# Altium schematic sheet JHDH-8412_1247.SchDoc: JHDH-8412-1247
size 469 x 304 mm; Revision: A; SheetNumber: 0; SheetTotal: 0; DrawnBy: CS
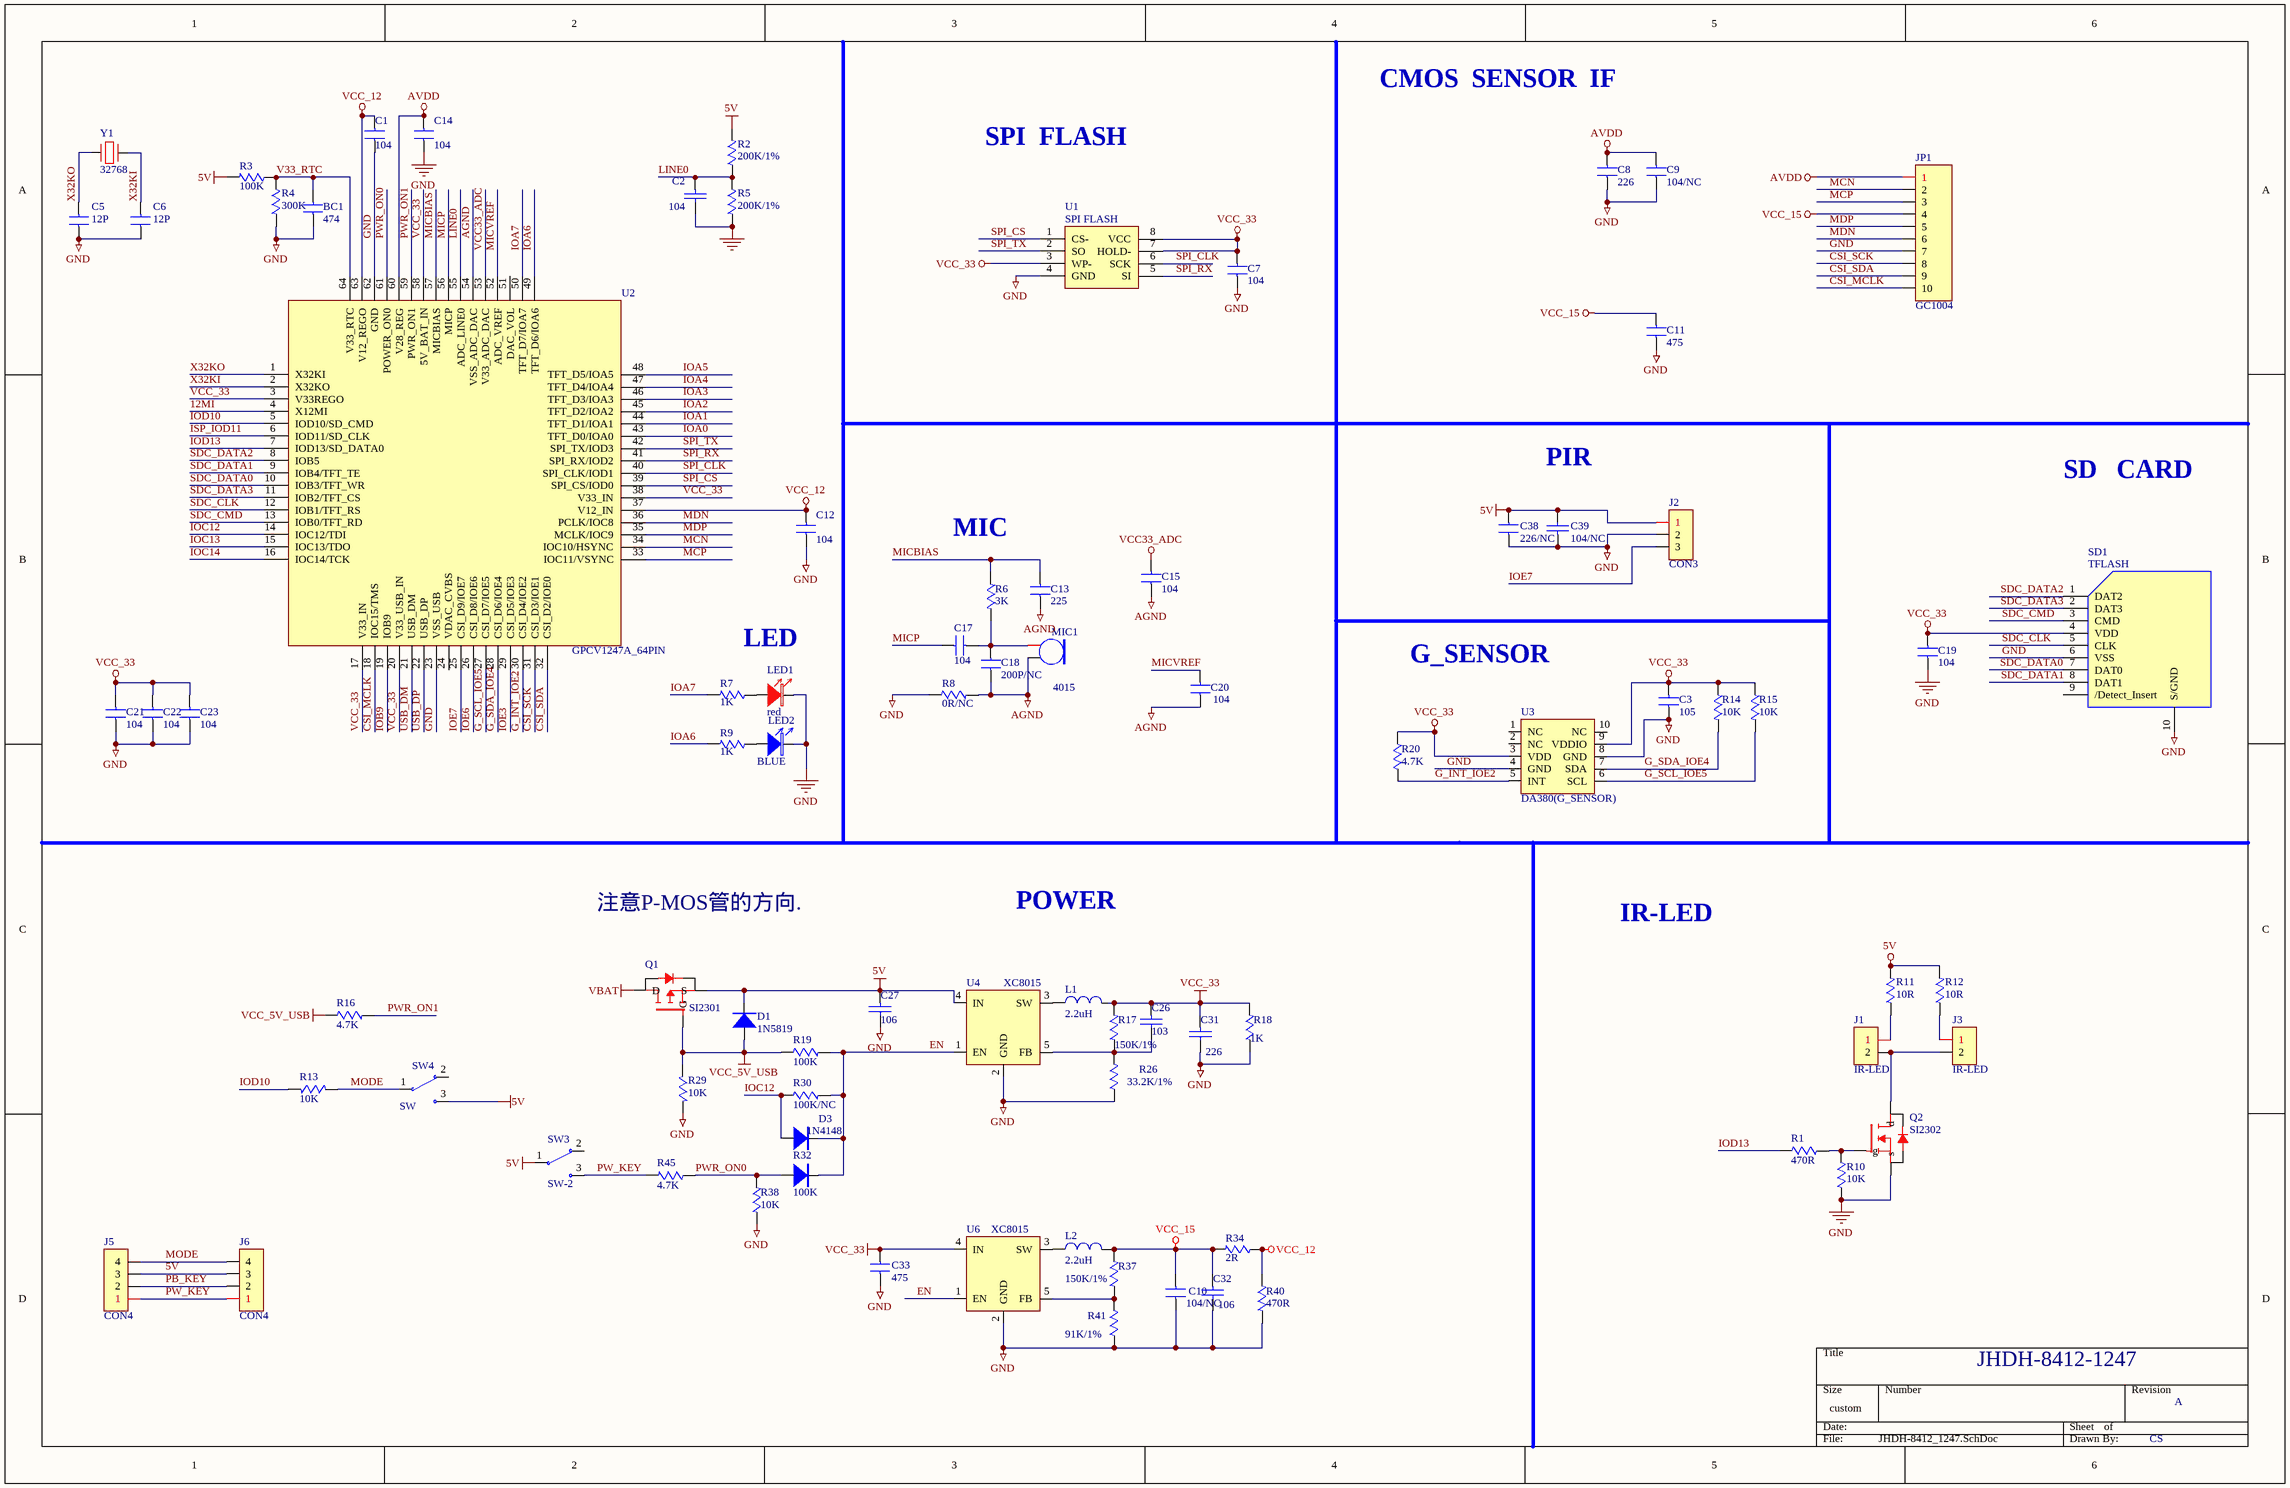
[diagram p0: JHDH-8412_1247.SchDoc]

## Parts
BC1  474  [C0402]
C1  104  [C0402]
C2  104  [C0402]
C3  105  [C0402]
C5  12P  [C0402]
C6  12P  [C0402]
C7  104  [C0402]
C8  226  [C0805]
C9  104/NC  [C0402]
C10  104/NC  [C0402]
C11  475  [C0603]
C12  104  [C0402]
C13  225  [C0402]
C14  104  [C0402]
C15  104  [C0402]
C17  104  [C0402]
C18  200P/NC  [C0402]
C19  104  [C0603]
C20  104  [C0402]
C21  104  [C0402]
C22  104  [C0402]
C23  104  [C0402]
C26  103  [C0402]
C27  106  [C0805]
C31  226  [C0805]
C32  106  [C0603]
C33  475  [C0603]
C38  226/NC  [C0805]
C39  104/NC  [c0402]
D1  1N5819  [DO-214AC]
D3  1N4148  [D1206]
J1  IR-LED  [PIN-2/2.54]
J2  CON3  [SIP3/2.0]
J3  IR-LED  [PIN-2/2.54]
J5  CON4  [PIN-4/1.27]
J6  CON4  [PIN-4/1.27]
JP1  GC1004  [10PIN-MIPI/0.5]
L1  2.2uH  [L3015]
L2  2.2uH  [L3015]
LED1  red  [LED0603R]
LED2  BLUE  [LED0603B]
MIC1  4015  [MICE]
Q1  SI2301  [SOT23]
Q2  SI2302  [SOT23]
R1  470R  [R0402]
R2  200K/1%  [R0402]
R3  100K  [R0402]
R4  300K  [R0402]
R5  200K/1%  [R0402]
R6  3K  [R0402]
R7  1K  [R0402]
R8  0R/NC  [R0402]
R9  1K  [R0402]
R10  10K  [R0402]
R11  10R  [R1206]
R12  10R  [R1206]
R13  10K  [R0402]
R14  10K  [R0402]
R15  10K  [R0402]
R16  4.7K  [R0402]
R17  150K/1%  [R0402]
R18  1K  [R0402]
R19  100K  [R0402]
R20  4.7K  [R0402]
R26  33.2K/1%  [R0402]
R29  10K  [R0402]
R30  100K/NC  [R0402]
R32  100K  [R0402]
R34  2R  [R0805]
R37  150K/1%  [R0402]
R38  10K  [R0402]
R40  470R  [R0402]
R41  91K/1%  [R0402]
R45  4.7K  [R0402]
SD1  TFLASH  [TFC-0002]
SW3  SW-2  [SW/MK-12C01]
SW4  SW  [SW/MK-12C01]
U1  SPI FLASH  [SOP8]
U2  GPCV1247A_64PIN  [LQFP64-0.4]
U3  DA380(G_SENSOR)  [QFN16-3*3-0.5-DA380]
U4  XC8015  [SOT23-5]
U6  XC8015  [SOT23-5]
Y1  32768  [XTAL-1.5X7]

## Nets
5V: C27.1 C38.1 C39.2 D1.2(K) J2.1 J5.3 J6.3 Q1.2(S) R2.2 R3.2 R11.2 R12.2 SW3.1 SW4.3 U4.4(IN)
AGND: C13.2 C15.2 C18.1 C20.2 MIC1.2 R8.2 U2.54(VSS_ADC_DAC)
AVDD: C8.1 C9.1 C14.1 JP1.1 U2.60(V28_REG)
GND: BC1.2 C1.2 C2.2 C3.2 C5.2 C6.2 C7.2 C8.2 C9.2 C10.2 C11.2 C12.2 C14.2 C19.2 C21.2 C22.2 C23.2 C27.2 C31.2 C32.2 C33.1 C38.2 C39.1 J2.2 JP1.7 LED1.2(K) LED2.2(K) Q2.2(s) R4.1 R5.1 R8.1 R10.1 R18.1 R26.1 R29.2 R38.1 R40.1 R41.1 SD1.6(VSS) SD1.10(S/GND) U1.4(GND) U2.23(VSS_USB) U2.62(GND) U3.4(GND) U3.8(GND) U4.2(GND) U6.2(GND)
VBAT: Q1.3(D)
VCC33_ADC: C15.1 U2.53(V33_ADC_DAC)
VCC_5V_USB: D1.1(A) Q1.1(G) R16.1 R19.1 R29.1
VCC_12: C1.1 C12.1 R34.1 R40.2 U2.37(V12_IN) U2.63(V12_REGO)
VCC_15: C10.1 C11.1 C32.1 JP1.4 L2.2 R34.2 R37.2
VCC_33: C3.1 C7.1 C19.1 C21.1 C22.1 C23.1 C26.1 C31.1 C33.2 L1.2 R14.1 R15.1 R17.2 R18.2 R20.1 SD1.4(VDD) U1.3(WP-) U1.7(HOLD-) U1.8(VCC) U2.3(V33REGO) U2.17(V33_IN) U2.20(V33_USB_IN) U2.38(V33_IN) U2.58(5V_BAT_IN) U3.3(VDD) U3.9(VDDIO) U6.4(IN)
12MI: U2.4(X12MI)
CSI_MCLK: JP1.10 U2.18(IOC15/TMS)
CSI_SCK: JP1.8 U2.31(CSI_D3/IOE1)
CSI_SDA: JP1.9 U2.32(CSI_D2/IOE0)
EN: D3.2(K) R19.2 R30.2 R32.2(K) U4.1(EN) U6.1(EN)
G_INT_IOE2: R20.2 U2.30(CSI_D4/IOE2) U3.5(INT)
G_SCL_IOE5: R15.2 U2.27(CSI_D7/IOE5) U3.6(SCL)
G_SDA_IOE4: R14.2 U2.28(CSI_D6/IOE4) U3.7(SDA)
IOA0: U2.43(TFT_D0/IOA0)
IOA1: U2.44(TFT_D1/IOA1)
IOA2: U2.45(TFT_D2/IOA2)
IOA3: U2.46(TFT_D3/IOA3)
IOA4: U2.47(TFT_D4/IOA4)
IOA5: U2.48(TFT_D5/IOA5)
IOA6: R9.2 U2.49(TFT_D6/IOA6)
IOA7: R7.2 U2.50(TFT_D7/IOA7)
IOB9: U2.19(IOB9)
IOC12: D3.1(A) R30.1 U2.14(IOC12/TDI)
IOC13: U2.15(IOC13/TDO)
IOC14: U2.16(IOC14/TCK)
IOD10: R13.1 U2.5(IOD10/SD_CMD)
IOD13: R1.1 U2.7(IOD13/SD_DATA0)
IOE3: U2.29(CSI_D5/IOE3)
IOE6: U2.26(CSI_D8/IOE6)
IOE7: J2.3 U2.25(CSI_D9/IOE7)
ISP_IOD11: U2.6(IOD11/SD_CLK)
LINE0: C2.1 R2.1 R5.2 U2.55(ADC_LINE0)
MCN: JP1.2 U2.34(IOC10/HSYNC)
MCP: JP1.3 U2.33(IOC11/VSYNC)
MDN: JP1.6 U2.36(PCLK/IOC8)
MDP: JP1.5 U2.35(MCLK/IOC9)
MICBIAS: C13.1 R6.1 U2.57(MICBIAS)
MICP: C17.1 U2.56(MICP)
MICVREF: C20.1 U2.52(ADC_VREF)
MODE: J5.4 J6.4 R13.2 SW4.1
PB_KEY: J5.2 J6.2
PW_KEY: J5.1 J6.1 R45.2 SW3.3
PWR_ON0: R32.1(A) R38.2 R45.1 U2.61(POWER_ON0)
PWR_ON1: R16.2 U2.59(PWR_ON1)
SDC_CLK: SD1.5(CLK) U2.12(IOB1/TFT_RS)
SDC_CMD: SD1.3(CMD) U2.13(IOB0/TFT_RD)
SDC_DATA0: SD1.7(DAT0) U2.10(IOB3/TFT_WR)
SDC_DATA1: SD1.8(DAT1) U2.9(IOB4/TFT_TE)
SDC_DATA2: SD1.1(DAT2) U2.8(IOB5)
SDC_DATA3: SD1.2(DAT3) U2.11(IOB2/TFT_CS)
SPI_CLK: U1.6(SCK) U2.40(SPI_CLK/IOD1)
SPI_CS: U1.1(CS-) U2.39(SPI_CS/IOD0)
SPI_RX: U1.5(SI) U2.41(SPI_RX/IOD2)
SPI_TX: U1.2(SO) U2.42(SPI_TX/IOD3)
USB_DM: U2.21(USB_DM)
USB_DP: U2.22(USB_DP)
V33_RTC: BC1.1 R3.1 R4.2 U2.64(V33_RTC)
X32KI: C6.1 U2.2(X32KO) Y1.2
X32KO: C5.1 U2.1(X32KI) Y1.1
NetC17_2: C17.2 C18.2 MIC1.1 R6.2
NetC26_2: C26.2 R17.1 R26.2 U4.5(FB)
NetJ1_1: J1.1 R11.1
NetJ1_2: J1.2 J3.2 Q2.3(d)
NetJ3_1: J3.1 R12.1
NetL1_1: L1.1 U4.3(SW)
NetL2_1: L2.1 U6.3(SW)
NetLED1_1: LED1.1(A) R7.1
NetLED2_1: LED2.1(A) R9.1
NetQ2_1: Q2.1(g) R1.2 R10.2
NetR37_1: R37.1 R41.2 U6.5(FB)

Not connected (* = marked no-connect by the designer): SD1 9(/Detect_Insert); SW3 2; SW4 2; U2 24(VDAC_CVBS) 51(DAC_VOL); U3 1(NC) 2(NC) 10(NC)

## Notes on the sheet
- CMOS  SENSOR  IF
- SPI  FLASH
- PIR
- SD   CARD
- MIC
- LED
- G_SENSOR
- 注意P-MOS管的方向.
- POWER
- IR-LED

## Library data of the parts
BC1 C1 C3 C5-C15 C17-C23 C33 C39 = CAP: Capacitor
  BC1 C1 C3 C5-C15 C17-C23 C33: Value: *
C2 C26 C27 C31 C32 = CAP: 贴片电容
C38 = CAP: 电容
D1 = 1N5819: 肖特基二极管
D3 R32 = DIODE: 二极管
J1 J3 = CON2: Connector; Value: 0.02
J2 = CON3: Connector; Value: 0.03
J5 J6 = CON4: Connector; Value: 0.04
JP1 = CON10: Connector; Value: 0.09
L1 L2 = L-1: 电感
LED1 = LED-R: LED/红色
LED2 = LED-B: LED/blue; Value: *
MIC1 = MICROPHONE: 咪头
Q1 = MOSFETP: 场效应管/P
Q2 = MOSFETN: Mosfet/N
R1-R5 R10-R13 R17-R19 R26 R29 R30 R37 R38 R41 R45 = RES: 贴片电阻
R6-R9 R14-R16 R20 R34 R40 = RES: Resistor
  R6-R9 R14 R15 R20 R34 R40: Value: *
SD1 = SD-MICRO: 外卡卡座
SW3 SW4 = SW-2: Slide Switch; Value: *
U1 = AT25010A
U2 = GPCV12417A_64PIN
U3 = DA380: G-Sensor
U4 U6 = BL8021: 升压IC
Y1 = CRYSTAL